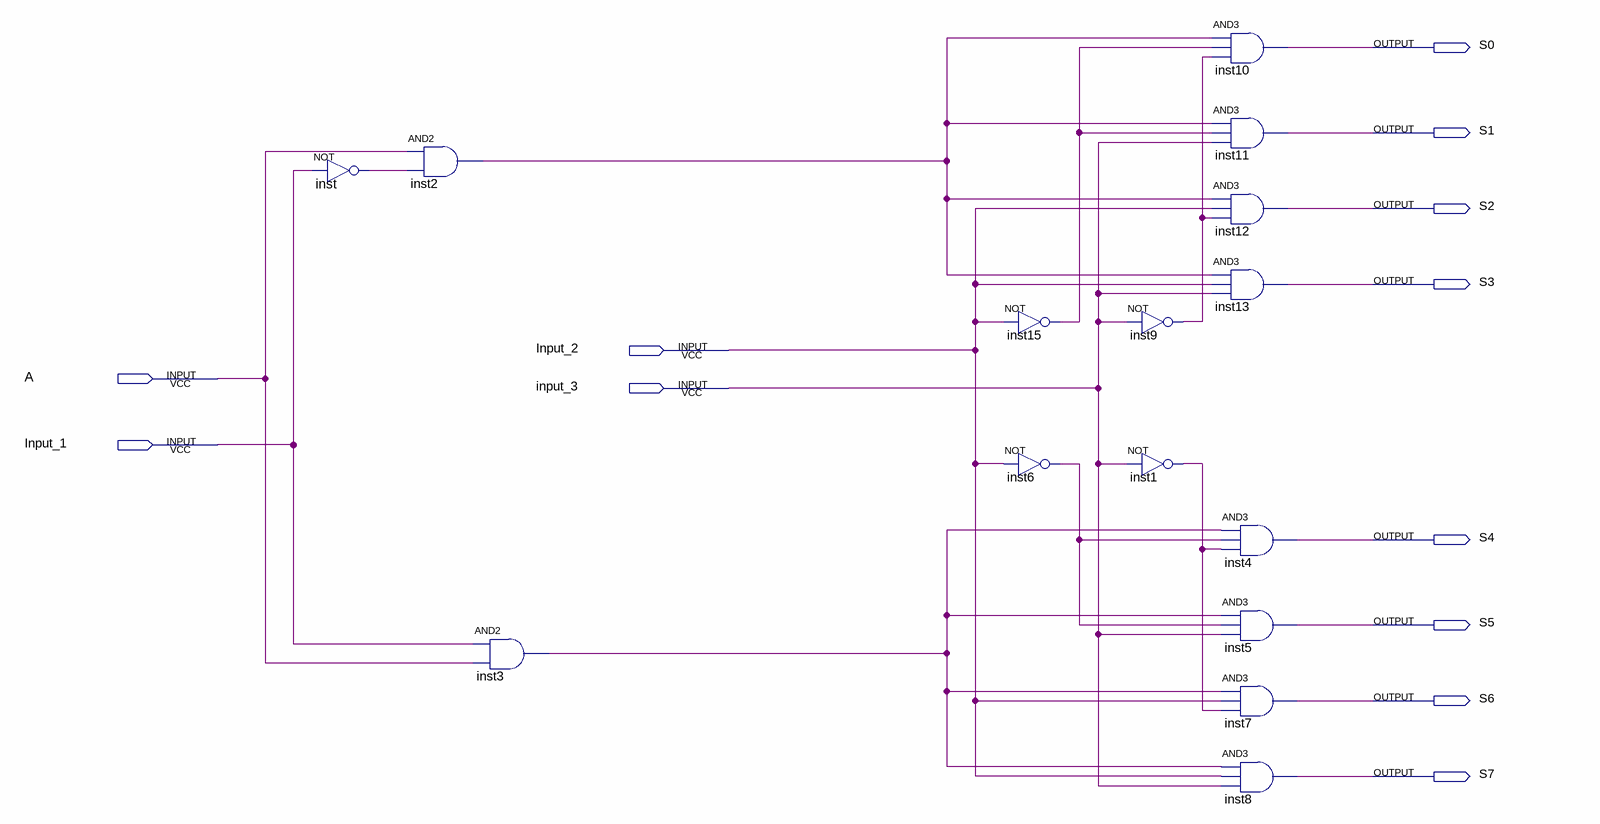
[diagram p0: schematic sheet]
// Quartus schematic demux_1x8_bystruct.bdf as structural Verilog: 15 symbols, 12 pins
module demux_1x8_bystruct (
  input  Input_2,
  input  A,
  input  input_3,
  input  Input_1,
  output S0,
  output S1,
  output S2,
  output S3,
  output S4,
  output S5,
  output S6,
  output S7
);

  wire inst1_out, inst2_out, inst3_out, inst6_out, inst9_out, inst15_out, inst_out;

  not inst (inst_out, Input_1);
  and inst2 (inst2_out, A, inst_out);
  and inst3 (inst3_out, Input_1, A);
  not inst15 (inst15_out, Input_2);
  not inst6 (inst6_out, Input_2);
  not inst9 (inst9_out, input_3);
  not inst1 (inst1_out, input_3);
  and inst10 (S0, inst2_out, inst15_out, inst9_out);
  and inst11 (S1, inst2_out, inst15_out, input_3);
  and inst12 (S2, inst2_out, Input_2, inst9_out);
  and inst13 (S3, inst2_out, Input_2, input_3);
  and inst4 (S4, inst3_out, inst6_out, inst1_out);
  and inst5 (S5, inst3_out, inst6_out, input_3);
  and inst7 (S6, inst3_out, Input_2, inst1_out);
  and inst8 (S7, inst3_out, Input_2, input_3);
endmodule
